# Altium project robot-cortex.PrjPCB (part 1 of 2)
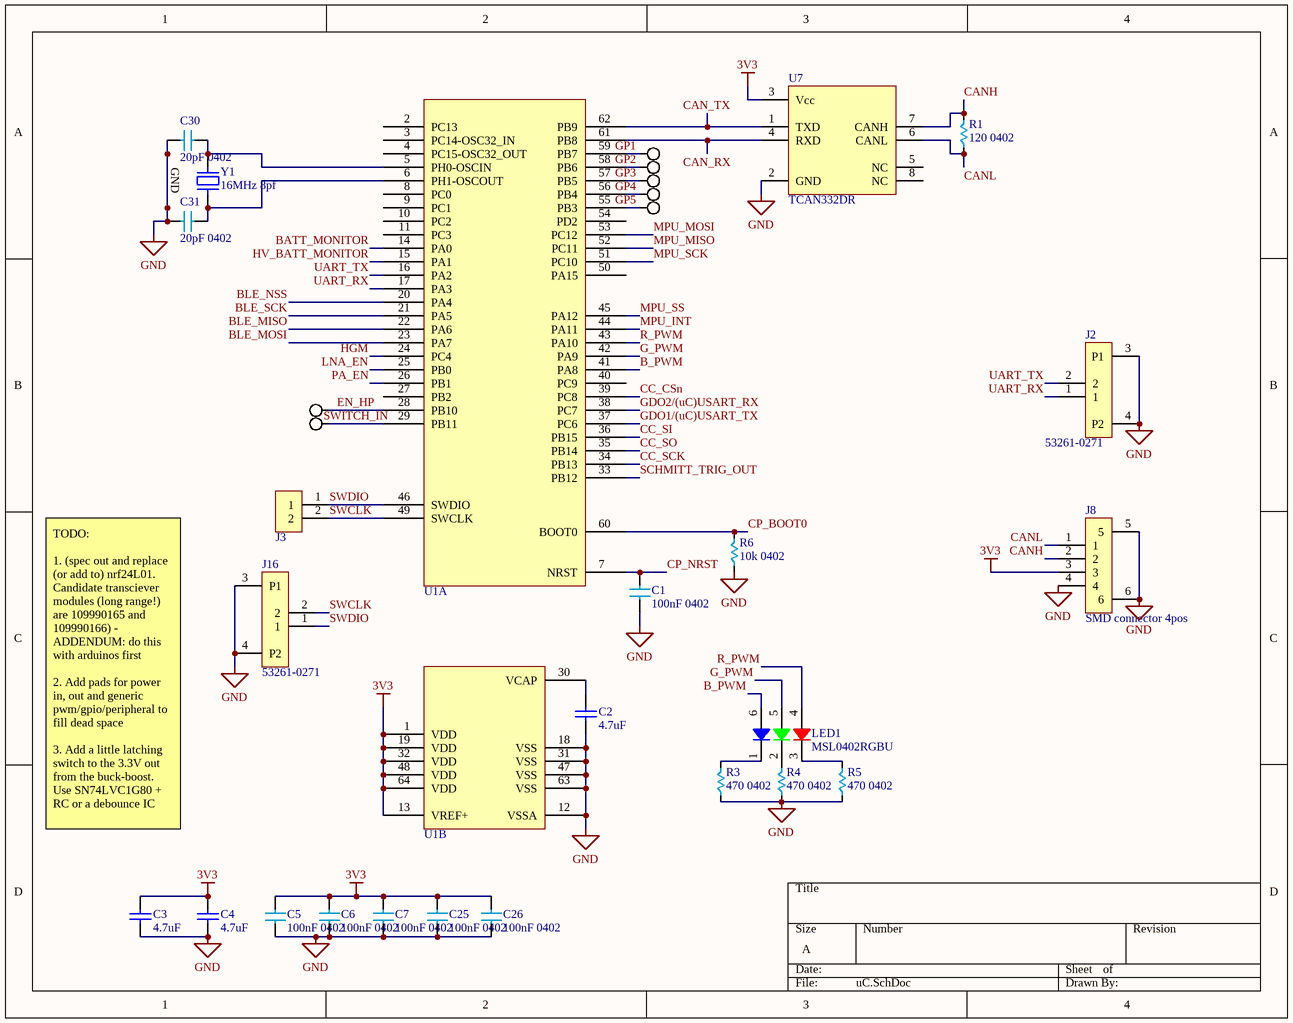
[diagram p0: uC.SchDoc]
6 sheets, 149 parts. Net scope: global (net labels, ports and power ports of the same name join across sheets).
Board file: pcb.PcbDoc
Sheets:
  uC.SchDoc
  power-management.SchDoc
  cp2102.SchDoc
  mpu6500.SchDoc
  CC1101-CC1190.SchDoc
  nrf52-coprocessor.SchDoc

## Sheet uC.SchDoc
size A

### Parts
C1  100nF 0402  [C0402]
C2  value 4.7uF  [C0603]  (hidden comment: 4.7uF 0603)
C3  value 4.7uF  [C0603]  (hidden comment: 4.7uF 0603)
C4  value 4.7uF  [C0603]  (hidden comment: 4.7uF 0603)
C5  100nF 0402  [C0402]
C6  100nF 0402  [C0402]
C7  100nF 0402  [C0402]
C25  100nF 0402  [C0402]
C26  100nF 0402  [C0402]
C30  20pF 0402  [C0402]
C31  20pF 0402  [C0402]
J2  53261-0271  [0532610271]
J3  Header 2  [DUAL_PADS]  (value not drawn)
J5  PAD-SINGLE  [PAD-SINGLE]  (value not drawn)
J6  PAD-SINGLE  [PAD-SINGLE]  (value not drawn)
J8  SMD connector 4pos  [0532610471]
J9  PAD-SINGLE  [PAD-SINGLE]  (value not drawn)
J10  PAD-SINGLE  [PAD-SINGLE]  (value not drawn)
J11  PAD-SINGLE  [PAD-SINGLE]  (value not drawn)
J12  PAD-SINGLE  [PAD-SINGLE]  (value not drawn)
J13  PAD-SINGLE  [PAD-SINGLE]  (value not drawn)
J16  53261-0271  [533980271]
LED1  MSL0402RGBU  [MSL0402RGBU]
R1  120 0402  [R0402]
R3  470 0402  [R0402]
R4  470 0402  [R0402]
R5  470 0402  [R0402]
R6  10k 0402  [R0402]
U1  STM32F730R8T6  [QFP-64]  (value not drawn)  (parts A,B of 2)
U7  TCAN332DR  [SOIC8-D0008A]
Y1  16MHz 8pf  [NDK NX3225GA]

### Nets
3V3: C3.2 C4.2 C5.1 C6.1 C7.1 C25.1 C26.1 J8.3 U1.1(VDD) U1.13(VREF+) U1.19(VDD) U1.32(VDD) U1.48(VDD) U1.64(VDD) U7.3(Vcc)
GND: C1.2 C2.1 C3.1 C4.1 C5.2 C6.2 C7.2 C25.2 C26.2 C30.2 C31.2 J2.3(P1) J2.4(P2) J8.4 J8.5 J8.6 J16.3(P1) J16.4(P2) R3.2 R4.2 R5.2 R6.2 U1.12(VSSA) U1.18(VSS) U1.31(VSS) U1.47(VSS) U1.63(VSS) U7.2(GND) Y1.2(GND) Y1.4(GND)
B_PWM: LED1.6 U1.41(PA8)
BATT_MONITOR: U1.14(PA0)
BLE_MISO: U1.22(PA6)
BLE_MOSI: U1.23(PA7)
BLE_NSS: U1.20(PA4)
BLE_SCK: U1.21(PA5)
CAN_RX: U1.61(PB8) U7.4(RXD)
CAN_TX: U1.62(PB9) U7.1(TXD)
CANH: J8.2 R1.1 U7.7(CANH)
CANL: J8.1 R1.2 U7.6(CANL)
CC_CSn: U1.39(PC8)
CC_SCK: U1.34(PB13)
CC_SI: U1.36(PB15)
CC_SO: U1.35(PB14)
CP_BOOT0: R6.1 U1.60(BOOT0)
CP_NRST: C1.1 U1.7(NRST)
EN_HP: J12.1 U1.28(PB10)
G_PWM: LED1.5 U1.42(PA9)
GDO1/(uC)USART_TX: U1.37(PC6)
GDO2/(uC)USART_RX: U1.38(PC7)
GP1: J5.1 U1.59(PB7)
GP2: J6.1 U1.58(PB6)
GP3: J9.1 U1.57(PB5)
GP4: J10.1 U1.56(PB4)
GP5: J11.1 U1.55(PB3)
HGM: U1.24(PC4)
HV_BATT_MONITOR: U1.15(PA1)
LNA_EN: U1.25(PB0)
MPU_INT: U1.44(PA11)
MPU_MISO: U1.52(PC11)
MPU_MOSI: U1.53(PC12)
MPU_SCK: U1.51(PC10)
MPU_SS: U1.45(PA12)
PA_EN: U1.26(PB1)
R_PWM: LED1.4 U1.43(PA10)
SCHMITT_TRIG_OUT: U1.33(PB12)
SWCLK: J3.2 J16.2 U1.49(SWCLK)
SWDIO: J3.1 J16.1 U1.46(SWDIO)
SWITCH_IN: J13.1 U1.29(PB11)
UART_RX: J2.1 U1.17(PA3)
UART_TX: J2.2 U1.16(PA2)
NetC2_2: C2.2 U1.30(VCAP)
NetC30_1: C30.1 U1.5(PH0-OSCIN) Y1.1
NetC31_1: C31.1 U1.6(PH1-OSCOUT) Y1.3
NetLED1_1: LED1.1 R3.1
NetLED1_2: LED1.2 R4.1
NetLED1_3: LED1.3 R5.1

Not connected (* = marked no-connect by the designer): U1 2(PC13) 3(PC14-OSC32_IN) 4(PC15-OSC32_OUT) 8(PC0) 9(PC1) 10(PC2) 11(PC3) 27(PB2) 40(PC9) 50(PA15) 54(PD2); U7 5(NC) 8(NC)

### Notes on the sheet
- TODO:
  1. (spec out and replace (or add to) nrf24L01. Candidate transciever modules (long range!) are 109990165 and 109990166) - ADDENDUM: do this with arduinos first
  2. Add pads for power in, out and generic pwm/gpio/peripheral to fill dead space
  3. Add a little latching switch to the 3.3V out from the buck-boost. Use SN74LVC1G80 + RC or a debounce IC

### Library data of the parts
C1 C5-C7 C25 C26 = C0402-100nF
C2-C4 = C-4.7uF-0603: Manufacturer: Samsung; Manufacturer Part Number: CL05F104ZO5NNNC; Description 1: Cap Ceramic 0.1uF 16V Y5V -20% to 80% SMD 0402 85C T/R; Material: Ceramic; Tolerance: 80%; Capacitance: 100nF; Dielectric: Y5V; Voltage Rating: 16V; Description 2: Cap Ceramic 4.7uF 6.3V X5R 20% SMD 0603 85C Paper T/R; Voltage Rating (DC): 6.3V; Published: 8-Jun-2000; LatestRevisionDate: 17-Jul-2002; LatestRevisionNote: Re-released for DXP Platform.; PackageReference: RAD-0.3; Publisher: Altium Limited; Supplier 1: Digi-Key; Supplier Part Number 1: 1276-1004-6-ND; Stock: 8058560; Pricing: 1=0.1, 10=0.024, 100=0.0106, 500=0.00756, 1000=0.00595, 2500=0.00541, 5000=0.00497 (USD); Mount: Surface Mount; Case/Package: 0402; Case Code (Metric): 1005; Case Code (Imperial): 0402; Contact Plating: Tin; Min Operating Temperature: -30°C; Max Operating Temperature: 85°C; Packaging: Tape and Reel; Length: 1mm; Height: 0.5mm; Width: 0.02inch; Thickness: 0.022inch; Depth: 0.5mm; Radiation Hardening: No; ComponentLink1URL: http://www1.futureelectronics.com/doc/SAMSUNG/CL05F104ZO5NNNC.pdf; ComponentLink1Description: http://www1.futureelectronics.com/doc/SAMSUNG/CL05F104ZO5NNNC.pdf; ComponentLink2URL: https://www.verical.com/server-webapp/html/getDatasheet?partID=358403; ComponentLink2Description: https://www.verical.com/server-webapp/html/getDatasheet?partID=358403; ComponentLink3URL: https://produktinfo.conrad.com/datenblaetter/450000-474999/458504-da-01-en-VS_KONDENSATOR_0402.pdf; ComponentLink3Description: https://produktinfo.conrad.com/datenblaetter/450000-474999/458504-da-01-en-VS_KONDENSATOR_0402.pdf; Supplier 2: Digi-Key; Supplier Part Number 2: 1276-1907-6-ND; Manufacturer Part Number 2: CL10A475MQ8NNNC; Package Quantity: 4000; Lead Free: Lead Free; ComponentLink4URL: http://www.samsungsem.com/kr/support/product-search/mlcc/CL10A475MQ8NNNC.jsp?src-supplier=Digi-Key; ComponentLink4Description: http://www.samsungsem.com/kr/support/product-search/mlcc/CL10A475MQ8NNNC.jsp?src-supplier=Digi-Key; ComponentLink5URL: https://www.verical.com/server-webapp/html/getDatasheet?partID=358407&src-supplier=Verical; ComponentLink5Description: https://www.verical.com/server-webapp/html/getDatasheet?partID=358407&src-supplier=Verical; ComponentLink6URL: http://www1.futureelectronics.com/doc/SAMSUNG%20PASSIVE/CL05B104KQ5NNNC.pdf?src-supplier=Future+Electronics; ComponentLink6Description: http://www1.futureelectronics.com/doc/SAMSUNG%20PASSIVE/CL05B104KQ5NNNC.pdf?src-supplier=Future+Electronics
C30 C31 = C0402-20pF
J2 J16 = 53261-0271: Headers & Wire Housings 1.25MM HDR 2 CKT Right-Angle; Manufacturer: Molex; Gender: Male; Voltage Rating: 125V; Number of Positions: 2; Current Rating: 1A; Contact Resistance: 20mR; Insulation Resistance: 100MR; Glow Wire Compliant: Non-compliant; Supplier 1: Digi-Key; Supplier Part Number 1: WM7620TR-ND; Manufacturer Part Number 1: 53261-0271; Description 1: Headers & Wire Housings 1.25MM HDR 2 CKT Right-Angle; Stock: 85000; Pricing: 1000=0.4904, 2000=0.45975, 3000=0.44443, 5000=0.4291, 10000=0.40765, 25000=0.39845 (USD); Mount: Surface Mount; Color: Beige; Housing Material: Thermoplastic; Contact Material: Bronze,Tin; Contact Plating: Tin; Min Operating Temperature: -40°C; Max Operating Temperature: 85°C; Packaging: Tape and Reel; Termination: SMD/SMT; Number of Rows: 1; Number of Contacts: 2; Orientation: Right Angle; Package Quantity: 1000; Voltage Rating (AC): 125V; Number of Circuits: 2; Voltage Rating (DC): 125V; Working Voltage: 125V; Pitch: 1.25mm; Lead Pitch: 1.25mm; Radiation Hardening: No; REACH SVHC: Unknown; Lead Free: Lead Free; Flammability Rating: UL94 V-0; ComponentLink1URL: http://uk.rs-online.com/webdocs/13c4/0900766b813c44b8.pdf; ComponentLink1Description: http://uk.rs-online.com/webdocs/13c4/0900766b813c44b8.pdf; ComponentLink2URL: http://www.molex.com/webdocs/datasheets/pdf/en-us/0532610271_PCB_HEADERS.pdf; ComponentLink2Description: http://www.molex.com/webdocs/datasheets/pdf/en-us/0532610271_PCB_HEADERS.pdf; ComponentLink3URL: http://www.alliedelec.com/m/d/74d14d19c60ab078e4881c4c1bd42ef7.pdf; ComponentLink3Description: http://www.alliedelec.com/m/d/74d14d19c60ab078e4881c4c1bd42ef7.pdf; ComponentLink4URL: http://www.farnell.com/datasheets/2697765.pdf; ComponentLink4Description: http://www.farnell.com/datasheets/2697765.pdf; ComponentLink5URL: http://www.farnell.com/datasheets/2144535.pdf; ComponentLink5Description: http://www.farnell.com/datasheets/2144535.pdf; ComponentLink6URL: http://www.farnell.com/datasheets/1626147.pdf; ComponentLink6Description: http://www.farnell.com/datasheets/1626147.pdf; ComponentLink7URL: http://www.mouser.com/ds/2/276/0532610271_PCB_HEADERS-171053.pdf; ComponentLink7Description: http://www.mouser.com/ds/2/276/0532610271_PCB_HEADERS-171053.pdf; ComponentLink8URL: http://www.farnell.com/datasheets/2038817.pdf; ComponentLink8Description: http://www.farnell.com/datasheets/2038817.pdf; ComponentLink9URL: http://www.jameco.com/Jameco/Products/ProdDS/1932547.pdf; ComponentLink9Description: http://www.jameco.com/Jameco/Products/ProdDS/1932547.pdf
J3 = DUAL_PADS
J5 J6 J9-J13 = PAD-SINGLE: Single Thru Hole Pad
J8 = 0532610471: Headers & Wire Housings 1.25MM HDR 4 CKT Right-Angle; Manufacturer: Molex; Manufacturer Part Number 1: 53261-0471; Contact Resistance: 20mR; Number of Positions: 4; Current Rating: 1A; Voltage Rating (AC): 125V; Insulation Resistance: 100MR; Gender: Male; Glow Wire Compliant: Non-compliant; Supplier 1: Digi-Key; Supplier Part Number 1: WM7622DKR-ND; Description 1: Headers & Wire Housings 1.25MM HDR 4 CKT Right-Angle; Stock: 42057; Pricing: 1=1.24, 10=1.089, 100=0.9397, 500=0.76884 (USD); Mount: Surface Mount; Contact Plating: Tin; Contact Material: Bronze,Tin; Color: Beige; Housing Material: Thermoplastic; Min Operating Temperature: -40°C; Max Operating Temperature: 85°C; Orientation: Right Angle; Number of Rows: 1; Packaging: Tape and Reel; Termination: SMD/SMT; Number of Contacts: 4; Voltage Rating: 125V; Package Quantity: 1000; Working Voltage: 125V; Number of Circuits: 4; Voltage Rating (DC): 125V; Pitch: 1.25mm; Lead Pitch: 1.25mm; Radiation Hardening: No; Flammability Rating: UL94 V-0; REACH SVHC: Unknown; Lead Free: Lead Free; ComponentLink1URL: http://www.mouser.com/ds/2/276/0532610471_PCB_HEADERS-170942.pdf; ComponentLink1Description: http://www.mouser.com/ds/2/276/0532610471_PCB_HEADERS-170942.pdf; ComponentLink2URL: http://uk.rs-online.com/webdocs/1380/0900766b8138010d.pdf; ComponentLink2Description: http://uk.rs-online.com/webdocs/1380/0900766b8138010d.pdf; ComponentLink3URL: http://www.farnell.com/datasheets/1867384.pdf; ComponentLink3Description: http://www.farnell.com/datasheets/1867384.pdf; ComponentLink4URL: http://www.molex.com/webdocs/datasheets/pdf/en-us/0532610471_PCB_HEADERS.pdf; ComponentLink4Description: http://www.molex.com/webdocs/datasheets/pdf/en-us/0532610471_PCB_HEADERS.pdf; ComponentLink5URL: https://www.alliedelec.com/m/d/74d14d19c60ab078e4881c4c1bd42ef7.pdf; ComponentLink5Description: https://www.alliedelec.com/m/d/74d14d19c60ab078e4881c4c1bd42ef7.pdf; ComponentLink6URL: http://www.jameco.com/Jameco/Products/ProdDS/1932555.pdf; ComponentLink6Description: http://www.jameco.com/Jameco/Products/ProdDS/1932555.pdf
LED1 = MSL0402RGBU: ROHM         MSL0402RGBU1             LED, Red, Green, Blue, SMD, Rectangular, R 20mA, G 20mA, B 20mA                          New; Color: Blue,Green,Red; Supplier 1: Digi-Key; Supplier Part Number 1: MSL0402RGBU1CT-ND; Manufacturer: Rohm; Manufacturer Part Number: MSL0402RGBU1; Stock 1: 23725; Pricing 1: 1=0.7, 10=0.549, 25=0.4576, 100=0.3942, 250=0.352, 500=0.30272, 1000=0.23373 (USD); Lens Style: Rectangular; Packaging: Cut Tape; REACH SVHC: No SVHC; Lead Free: Lead Free
R1 = R-120-0402: 120 Ohm 0402
R3-R5 = R-470-0402: Manufacturer: Yageo; Manufacturer Part Number: RC0402JR-07470RL; Description 1: RES SMD 470 OHM 5% 1/16W 0402; Tolerance: 5%; Voltage Rating: 50V; Resistance: 470R; Power Rating: 62.5mW; Temperature Coefficient: 100ppm/°C; Max Power Dissipation: 63mW; Supplier 1: Digi-Key; Supplier Part Number 1: 311-470JRDKR-ND; Stock: 2903670; Pricing: 1=0.1, 10=0.013, 100=0.0055, 1000=0.00245, 2500=0.00212, 5000=0.00176 (USD); Case/Package: 0402; Case Code (Metric): 1005; Case Code (Imperial): 0402; Min Operating Temperature: -55°C; Max Operating Temperature: 155°C; Packaging: Tape and Reel; Package Quantity: 1; Termination: SMD/SMT; Composition: Thick Film; Features: Moisture Resistant; Number of Terminations: 2; Military Standard: Not; Working Voltage: 50V; Length: 1mm; Height: 0.016inch; Width: 0.02inch; Depth: 0.5mm; REACH SVHC: Unknown; Lead Free: Lead Free; ComponentLink1URL: http://www.yageo.com/documents/recent/PYu-RC_Group_51_RoHS_L_10.pdf?src-supplier=Digi-Key; ComponentLink1Description: http://www.yageo.com/documents/recent/PYu-RC_Group_51_RoHS_L_10.pdf?src-supplier=Digi-Key; ComponentLink2URL: http://www.farnell.com/datasheets/1018594.pdf?src-supplier=Element14; ComponentLink2Description: http://www.farnell.com/datasheets/1018594.pdf?src-supplier=Element14; ComponentLink3URL: http://www.mouser.com/ds/2/447/PYu-RC0402_51_RoHS_L_6_r-8721.pdf?src-supplier=Mouser; ComponentLink3Description: http://www.mouser.com/ds/2/447/PYu-RC0402_51_RoHS_L_6_r-8721.pdf?src-supplier=Mouser
R6 = R-10k-0402: Value: 10k
U7 = TCAN332: Manufacturer: Texas Instruments; Description 1: TEXAS INSTRUMENTS         TCAN332DR             CAN Bus, 1, 1, 3 V, 3.6 V, SOIC; Receiver Hysteresis: 120mV; Data Rate: 1Mbps; Min Supply Voltage: 3V; Max Supply Voltage: 3.6V; Number of Transmit Buffers: 1; Supplier 1: Digi-Key; Supplier Part Number 1: 296-43711-1-ND; Manufacturer Part Number: TCAN332DR; RoHS: Yes; Category: Interface ICs; Stock: 14429; Pricing: 1=2.01000, 10=1.80200, 25=1.70000, 100=1.36000, 250=1.19000, 500=1.15600, 1000=0.91800 (USD); Mount: Surface Mount; Case/Package: SOIC; Number of Pins: 8; Min Operating Temperature: -40°C; Max Operating Temperature: 125°C; Packaging: Cut Tape; Number of Receive Buffers: 1; Lead Free: Lead Free; REACH SVHC: No SVHC; ComponentLink1URL: http://www.ti.com/lit/ds/symlink/tcan332.pdf?src-supplier=Digi-Key; ComponentLink1Description: http://www.ti.com/lit/ds/symlink/tcan332.pdf?src-supplier=Digi-Key; ComponentLink2URL: http://www.ti.com/lit/gpn/tcan332?src-supplier=Mouser; ComponentLink2Description: http://www.ti.com/lit/gpn/tcan332?src-supplier=Mouser; ComponentLink3URL: http://www.ti.com/general/docs/lit/getliterature.tsp?genericPartNumber=TCAN332&amp;&amp;fileType=pdf&src-supplier=Farnell; ComponentLink3Description: http://www.ti.com/general/docs/lit/getliterature.tsp?genericPartNumber=TCAN332&amp;&amp;fileType=pdf&src-supplier=Farnell; ComponentLink4URL: http://www.ti.com/general/docs/lit/getliterature.tsp?genericPartNumber=TCAN332&&fileType=pdf&src-supplier=Element14; ComponentLink4Description: http://www.ti.com/general/docs/lit/getliterature.tsp?genericPartNumber=TCAN332&&fileType=pdf&src-supplier=Element14
Y1 = NDK Crystal NX3225SA: SMT Crystal; Manufacturer: NDK; Manufacturer Part Number: NX3225SA-16.000000MHZ-T1; Description 2: CRYSTAL 16.0000MHZ 10PF SMD; Frequency Tolerance: 10ppm; Load Capacitance: 10pF; ESR (Equivalent Series Resistance): 80R; Supplier 1: Digi-Key; Supplier Part Number 1: 644-1049-1-ND; Supplier 2: Digi-Key; Supplier Part Number 2: 644-1100-6-ND; Stock: 72540; Pricing: 1=0.92, 10=0.812, 50=0.7592, 100=0.6709, 500=0.63558, 1000=0.52965 (USD); Mount: Surface Mount; Case/Package: SMD/SMT; Min Operating Temperature: -20°C; Max Operating Temperature: 70°C; Frequency: 16MHz; Frequency Stability: 10ppm; Packaging: Tape and Reel; Package Quantity: 3000; Length: 0.126inch; Height: 0.028inch; Width: 0.098inch; Lead Free: Lead Free; ComponentLink1URL: https://media.digikey.com/pdf/Data Sheets/NDK PDFs/NX3225SA-16.000000MHz-T1.pdf?src-supplier=Digi-Key; ComponentLink1Description: https://media.digikey.com/pdf/Data Sheets/NDK PDFs/NX3225SA-16.000000MHz-T1.pdf?src-supplier=Digi-Key

## Sheet power-management.SchDoc
size 304 x 177 mm
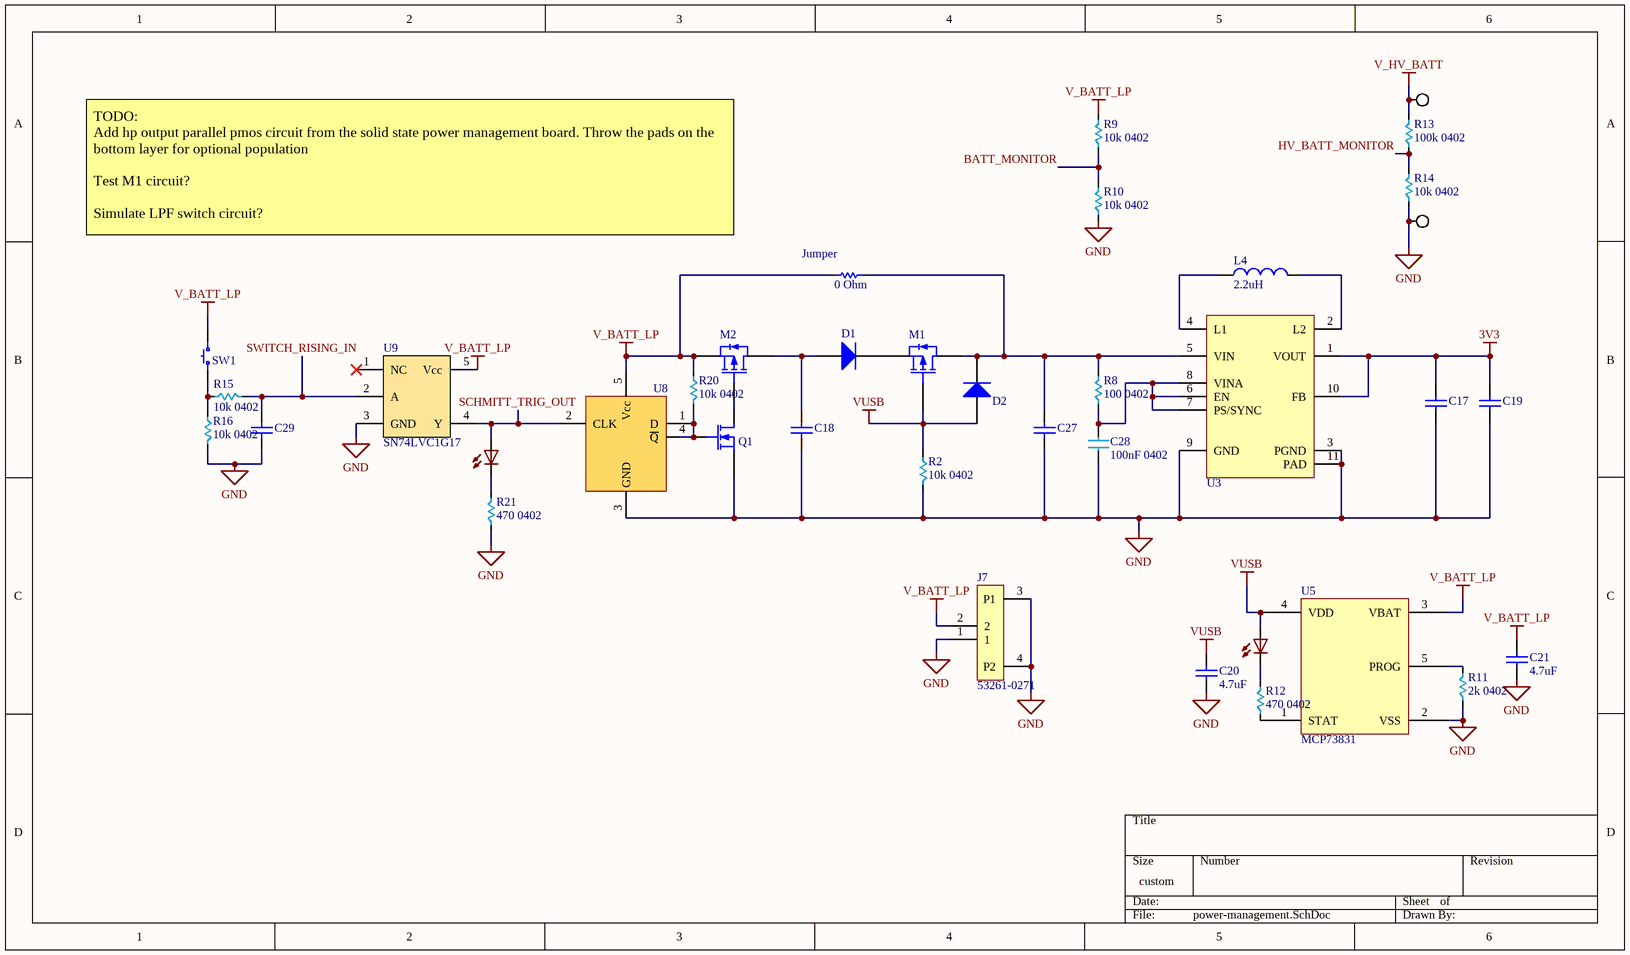
[diagram p1: power-management.SchDoc]

### Parts
0_Ohm  Jumper  [0805-1]
C17  10uF 0603  [C0603]  (value not drawn)
C18  10uF 0603  [C0603]  (value not drawn)
C19  10uF 0603  [C0603]  (value not drawn)
C20  value 4.7uF  [C0603]  (hidden comment: 4.7uF 0603)
C21  value 4.7uF  [C0603]  (hidden comment: 4.7uF 0603)
C27  10uF 0603  [C0603]  (value not drawn)
C28  100nF 0402  [C0402]
C29  10uF 0603  [C0603]  (value not drawn)
D1  NSR0530HT1G  [SOD-323]  (value not drawn)
D2  NSR0530HT1G  [SOD-323]  (value not drawn)
J7  53261-0271  [0532610271]
J18  PAD-SINGLE  [PAD-SINGLE]  (value not drawn)
J19  PAD-SINGLE  [PAD-SINGLE]  (value not drawn)
L4  2.2uH  [L1210]
LED3  LED WHITE 0603  [LED_0603]  (value not drawn)
LED4  LED WHITE 0603  [LED_0603]  (value not drawn)
M1  csd25402q3a  [SON65P330X90-8N]  (value not drawn)
M2  csd25402q3a  [SON65P330X90-8N]  (value not drawn)
Q1  n-mos low power  [SOT-23-3]  (value not drawn)
R2  10k 0402  [R0402]
R8  100 0402  [R0402]
R9  10k 0402  [R0402]
R10  10k 0402  [R0402]
R11  2k 0402  [R0402]
R12  470 0402  [R0402]
R13  100k 0402  [R0402]
R14  10k 0402  [R0402]
R15  10k 0402  [R0402]
R16  10k 0402  [R0402]
R20  10k 0402  [R0402]
R21  470 0402  [R0402]
SW1  EVQ-P7A01P  [EVQ-P7A01P]  (value not drawn)
U3  TPS63001DRCR  [DRC0010J]  (value not drawn)
U5  MCP73831  [SOT-23-5]
U8  SN74LVC1G80DCK  [DCK-SC70-TI]  (value not drawn)
U9  SN74LVC1G17  [DBV-SOT-23]

### Nets
3V3: C17.2 C19.2 U3.1(VOUT) U3.10(FB)
GND: C17.1 C18.1 C19.1 C20.1 C21.1 C27.1 C28.2 C29.2 J7.1 J7.3(P1) J7.4(P2) J19.1 Q1.2(S) R2.1 R10.2 R11.2 R14.2 R16.2 R21.2 U3.3(PGND) U3.9(GND) U3.11(PAD) U5.2(VSS) U8.3(GND) U9.3(GND)
V_BATT_LP: 0_Ohm.1 C21.2 J7.2 M2.3(S) R9.1 R20.2 SW1.2 U5.3(VBAT) U8.5(Vcc) U9.5(Vcc)
V_HV_BATT: J18.1 R13.1
VUSB: C20.2 D2.1(A) LED3.A M1.2(G) R2.2 U5.4(VDD)
BATT_MONITOR: R9.2 R10.1
HV_BATT_MONITOR: R13.2 R14.1
SCHMITT_TRIG_OUT: LED4.A U8.2(CLK) U9.4(Y)
SWITCH_RISING_IN: C29.1 R15.2 U9.2(A)
Net0_Ohm_2: 0_Ohm.2 C27.2 D2.2(K) M1.1(D) R8.1 U3.5(VIN)
NetC18_2: C18.2 D1.1(A) M2.1(D)
NetC28_1: C28.1 R8.2 U3.6(EN) U3.7(PS/SYNC) U3.8(VINA)
NetD1_2: D1.2(K) M1.3(S)
NetL4_1: L4.1 U3.4(L1)
NetL4_2: L4.2 U3.2(L2)
NetLED3_C: LED3.C R12.1
NetLED4_C: LED4.C R21.1
NetM2_2: M2.2(G) Q1.3(D)
NetQ1_1: Q1.1(G) R20.1 U8.1(D) U8.4(~{Q})
NetR11_1: R11.1 U5.5(PROG)
NetR12_2: R12.2 U5.1(STAT)
NetR15_1: R15.1 R16.1 SW1.1

Not connected (* = marked no-connect by the designer): U9 1(NC)*

### Notes on the sheet
- TODO:
  Add hp output parallel pmos circuit from the solid state power management board. Throw the pads on the bottom layer for optional population
  Test M1 circuit?
  Simulate LPF switch circuit?

### Library data of the parts
0_Ohm = R-0-0805: Manufacturer: Panasonic; Manufacturer Part Number: ERJ-6LWJR007V; Value: .007; Description 1: RES 0.007 OHM 5% 1/2W 0805; Resistance: 7mR; Temperature Coefficient: 300ppm/°C; Tolerance: 5%; Max Power Dissipation: 500mW; Footprint: 0805; Supplier 1: Digi-Key; Supplier Part Number 1: P19193DKR-ND; Stock: 3878; Pricing: 1=0.42, 10=0.321, 25=0.2444, 50=0.1816, 100=0.135, 250=0.11404, 500=0.09774, 1000=0.07447 (USD); Case/Package: 0805; Case Code (Metric): 2012; Case Code (Imperial): 0805; Min Operating Temperature: -55°C; Max Operating Temperature: 155°C; Packaging: Tape and Reel; Composition: Thick Film; Number of Terminations: 2; Features: Automotive AEC-Q200; Length: 0.079inch; Height: 0.032inch; Width: 0.049inch
C17-C19 C27 C29 = C-10.0uF-0603
C20 C21 = C-4.7uF-0603: as C2 on sheet uC; Published: 8-Jun-2000; LatestRevisionDate: 17-Jul-2002; LatestRevisionNote: Re-released for DXP Platform.; PackageReference: RAD-0.3; Publisher: Altium Limited; Supplier 1: Digi-Key; Supplier Part Number 1: 1276-1004-6-ND; Stock: 8058560; Pricing: 1=0.1, 10=0.024, 100=0.0106, 500=0.00756, 1000=0.00595, 2500=0.00541, 5000=0.00497 (USD); Mount: Surface Mount; Case/Package: 0402; Case Code (Metric): 1005; Case Code (Imperial): 0402; Contact Plating: Tin; Min Operating Temperature: -30°C; Max Operating Temperature: 85°C; Packaging: Tape and Reel; Length: 1mm; Height: 0.5mm; Width: 0.02inch; Thickness: 0.022inch; Depth: 0.5mm; Radiation Hardening: No; ComponentLink1URL: http://www1.futureelectronics.com/doc/SAMSUNG/CL05F104ZO5NNNC.pdf; ComponentLink1Description: http://www1.futureelectronics.com/doc/SAMSUNG/CL05F104ZO5NNNC.pdf; ComponentLink2URL: https://www.verical.com/server-webapp/html/getDatasheet?partID=358403; ComponentLink2Description: https://www.verical.com/server-webapp/html/getDatasheet?partID=358403; ComponentLink3URL: https://produktinfo.conrad.com/datenblaetter/450000-474999/458504-da-01-en-VS_KONDENSATOR_0402.pdf; ComponentLink3Description: https://produktinfo.conrad.com/datenblaetter/450000-474999/458504-da-01-en-VS_KONDENSATOR_0402.pdf; Supplier 2: Digi-Key; Supplier Part Number 2: 1276-1907-6-ND; Manufacturer Part Number 2: CL10A475MQ8NNNC; Package Quantity: 4000; Lead Free: Lead Free; ComponentLink4URL: http://www.samsungsem.com/kr/support/product-search/mlcc/CL10A475MQ8NNNC.jsp?src-supplier=Digi-Key; ComponentLink4Description: http://www.samsungsem.com/kr/support/product-search/mlcc/CL10A475MQ8NNNC.jsp?src-supplier=Digi-Key; ComponentLink5URL: https://www.verical.com/server-webapp/html/getDatasheet?partID=358407&src-supplier=Verical; ComponentLink5Description: https://www.verical.com/server-webapp/html/getDatasheet?partID=358407&src-supplier=Verical; ComponentLink6URL: http://www1.futureelectronics.com/doc/SAMSUNG%20PASSIVE/CL05B104KQ5NNNC.pdf?src-supplier=Future+Electronics; ComponentLink6Description: http://www1.futureelectronics.com/doc/SAMSUNG%20PASSIVE/CL05B104KQ5NNNC.pdf?src-supplier=Future+Electronics
C28 = C0402-100nF
D1 D2 = NSR0530HT1G: DIODE SCHOTTKY 30V 500MA SOD323; Manufacturer: ON Semiconductor; Forward Voltage: 620mV; Peak Reverse Current: 200uA; Element Configuration: Single; Supplier 1: Digi-Key; Supplier Part Number 1: NSR0530HT1GOSCT-ND; Manufacturer Part Number: NSR0530HT1G; Stock 1: 163499; Pricing 1: 1=0.16, 10=0.149, 100=0.081, 500=0.04986, 1000=0.03399 (USD); Mount: Surface Mount; Case/Package: SOD; Number of Pins: 2; Contact Plating: Tin; Min Operating Temperature: -55°C; Max Operating Temperature: 150°C; Packaging: Cut Tape; Average Rectified Current: 500mA; Max Repetitive Reverse Voltage (Vrrm): 30V; Forward Current: 500mA; Max Reverse Voltage (DC): 30V; REACH SVHC: No SVHC; Lead Free: Lead Free
J7 = 53261-0271: as J2 on sheet uC; Supplier 1: Digi-Key; Supplier Part Number 1: WM7620TR-ND; Manufacturer Part Number 1: 53261-0271; Description 1: Headers & Wire Housings 1.25MM HDR 2 CKT Right-Angle; Stock: 85000; Pricing: 1000=0.4904, 2000=0.45975, 3000=0.44443, 5000=0.4291, 10000=0.40765, 25000=0.39845 (USD); Mount: Surface Mount; Color: Beige; Housing Material: Thermoplastic; Contact Material: Bronze,Tin; Contact Plating: Tin; Min Operating Temperature: -40°C; Max Operating Temperature: 85°C; Packaging: Tape and Reel; Termination: SMD/SMT; Number of Rows: 1; Number of Contacts: 2; Orientation: Right Angle; Package Quantity: 1000; Voltage Rating (AC): 125V; Number of Circuits: 2; Voltage Rating (DC): 125V; Working Voltage: 125V; Pitch: 1.25mm; Lead Pitch: 1.25mm; Radiation Hardening: No; REACH SVHC: Unknown; Lead Free: Lead Free; Flammability Rating: UL94 V-0; ComponentLink1URL: http://uk.rs-online.com/webdocs/13c4/0900766b813c44b8.pdf; ComponentLink1Description: http://uk.rs-online.com/webdocs/13c4/0900766b813c44b8.pdf; ComponentLink2URL: http://www.molex.com/webdocs/datasheets/pdf/en-us/0532610271_PCB_HEADERS.pdf; ComponentLink2Description: http://www.molex.com/webdocs/datasheets/pdf/en-us/0532610271_PCB_HEADERS.pdf; ComponentLink3URL: http://www.alliedelec.com/m/d/74d14d19c60ab078e4881c4c1bd42ef7.pdf; ComponentLink3Description: http://www.alliedelec.com/m/d/74d14d19c60ab078e4881c4c1bd42ef7.pdf; ComponentLink4URL: http://www.farnell.com/datasheets/2697765.pdf; ComponentLink4Description: http://www.farnell.com/datasheets/2697765.pdf; ComponentLink5URL: http://www.farnell.com/datasheets/2144535.pdf; ComponentLink5Description: http://www.farnell.com/datasheets/2144535.pdf; ComponentLink6URL: http://www.farnell.com/datasheets/1626147.pdf; ComponentLink6Description: http://www.farnell.com/datasheets/1626147.pdf; ComponentLink7URL: http://www.mouser.com/ds/2/276/0532610271_PCB_HEADERS-171053.pdf; ComponentLink7Description: http://www.mouser.com/ds/2/276/0532610271_PCB_HEADERS-171053.pdf; ComponentLink8URL: http://www.farnell.com/datasheets/2038817.pdf; ComponentLink8Description: http://www.farnell.com/datasheets/2038817.pdf; ComponentLink9URL: http://www.jameco.com/Jameco/Products/ProdDS/1932547.pdf; ComponentLink9Description: http://www.jameco.com/Jameco/Products/ProdDS/1932547.pdf
J18 J19 = PAD-SINGLE: Single Thru Hole Pad
L4 = DFE322520FD-2R2M=P2: 2.2uH 1210
LED3 LED4 = LED_ESML0603: LED   Source: http://www.osram.convergy.de   Source: www.luxeon.com   Source: www.kingbright.com; Manufacturer: Dialight; Manufacturer Part Number: 5988070107F; Description 1: DIALIGHT - 5988070107F - LED, 0603, GREEN, 20MCD, 566NM; Color: Green; Lens Color: Colorless,Clear; Forward Voltage: 2V; Forward Current: 20mA; Wavelength: 570nm; Luminous Intensity: 20mcd; Viewing Angle: 140°; Lens Style: Flat,Rectangular,Diffused,Colorless,Clear; Dominant Wavelength: 568nm; Number of Elements: 1; Power Dissipation: 60mW; Reverse Voltage: 5V; Lens Transparency: Clear; Lens Size: 0.8mm; SPICEMODEL: NONE; SPICEPREFIX: D; SPICETYPE: diode; Supplier 1: Digi-Key; Supplier Part Number 1: 350-2035-6-ND; Stock: 221494; Pricing: 1=0.48, 10=0.346, 25=0.2652, 100=0.1731, 250=0.12692, 500=0.1077, 1000=0.08846 (USD); Mount: Surface Mount; Case/Package: 0603; Number of Pins: 2; Case Code (Metric): 1608; Case Code (Imperial): 0603; Min Operating Temperature: -30°C; Max Operating Temperature: 100°C; Package Quantity: 4000; Packaging: Tape and Reel; Illumination Color: Green; Test Current: 20mA; Number of LEDs: 1; Length: 1.6mm; Height: 0.7mm; Depth: 0.8mm; Width: 0.8mm; Radiation Hardening: No; Lead Free: Lead Free; REACH SVHC: No SVHC; ComponentLink1URL: http://www.mouser.com/ds/2/109/SMT_selector_guide-267443.pdf?src-supplier=Mouser; ComponentLink1Description: http://www.mouser.com/ds/2/109/SMT_selector_guide-267443.pdf?src-supplier=Mouser; ComponentLink2URL: http://uk.rs-online.com/webdocs/0ae2/0900766b80ae2975.pdf?src-supplier=RSComponents; ComponentLink2Description: http://uk.rs-online.com/webdocs/0ae2/0900766b80ae2975.pdf?src-supplier=RSComponents; ComponentLink3URL: http://www.farnell.com/datasheets/1720200.pdf?src-supplier=Element14; ComponentLink3Description: http://www.farnell.com/datasheets/1720200.pdf?src-supplier=Element14; ComponentLink4URL: https://media.digikey.com/pdf/Data%20Sheets/Dialight%20PDFs/598_Series_0603_Pkg.pdf?src-supplier=Digi-Key; ComponentLink4Description: https://media.digikey.com/pdf/Data%20Sheets/Dialight%20PDFs/598_Series_0603_Pkg.pdf?src-supplier=Digi-Key; ComponentLink5URL: http://www.farnell.com/datasheets/1484480.pdf?src-supplier=Element14; ComponentLink5Description: http://www.farnell.com/datasheets/1484480.pdf?src-supplier=Element14; ComponentLink6URL: https://www.alliedelec.com/m/d/745256ca487aea7b70ea31e2d673d5bb.pdf?src-supplier=Allied+Electronics; ComponentLink6Description: https://www.alliedelec.com/m/d/745256ca487aea7b70ea31e2d673d5bb.pdf?src-supplier=Allied+Electronics; ComponentLink7URL: http://www.onlinecomponents.com/productFiles/mf-DIA/mdei5980603.pdf?src-supplier=Onlinecomponents.com; ComponentLink7Description: http://www.onlinecomponents.com/productFiles/mf-DIA/mdei5980603.pdf?src-supplier=Onlinecomponents.com; ComponentLink8URL: https://www.verical.com/server-webapp/html/getDatasheet?partID=146438&src-supplier=Verical; ComponentLink8Description: https://www.verical.com/server-webapp/html/getDatasheet?partID=146438&src-supplier=Verical; ComponentLink9URL: http://www.dialight.com/Assets/Brochures_And_Catalogs/Indication/SMT_selector_guide.pdf?src-supplier=Future+Electronics; ComponentLink9Description: http://www.dialight.com/Assets/Brochures_And_Catalogs/Indication/SMT_selector_guide.pdf?src-supplier=Future+Electronics
Q1 = NDS351N: Manufacturer: ON Semiconductor / Fairchild; Rds On Max: 160mR; Input Capacitance: 140pF; Drain to Source Voltage (Vdss): 30V; Continuous Drain Current (ID): 1.1A; Max Power Dissipation: 460mW; Gate to Source Voltage (Vgs): 20V; Power Dissipation: 500mW; Element Configuration: Single; Rise Time: 16ns; Turn-Off Delay Time: 26ns; Number of Elements: 1; Turn-On Delay Time: 9ns; Supplier 1: Mouser; Manufacturer Part Number: NDS351N; Stock 1: 2166; Pricing 1: 1=0.46, 10=0.383, 50=0.383, 100=0.234, 1000=0.181, 10000=0.144 (USD); Mount: Surface Mount; Case/Package: TO-236-3; Number of Pins: 3; Weight: 0.03g; Min Operating Temperature: -55°C; Max Operating Temperature: 150°C; Package Quantity: 1; Packaging: Tape and Reel; Drain to Source Breakdown Voltage: 30V; Drain to Source Resistance: 160mR; Fall Time: 16ns; Current Rating: 1.1A; Voltage Rating (DC): 30V; Radiation Hardening: No; Lead Free: Contains Lead; ComponentLink1URL: https://www.verical.com/server-webapp/html/getDatasheet?partID=96049&src-supplier=Verical; ComponentLink1Description: https://www.verical.com/server-webapp/html/getDatasheet?partID=96049&src-supplier=Verical; ComponentLink2URL: https://www.fairchildsemi.com/package-drawings/MA/MA03B.pdf?src-supplier=Digi-Key; ComponentLink2Description: https://www.fairchildsemi.com/package-drawings/MA/MA03B.pdf?src-supplier=Digi-Key; ComponentLink3URL: http://www.fairchildsemi.com/ds/ND/NDS351N.pdf?src-supplier=Avnet+Europe; ComponentLink3Description: http://www.fairchildsemi.com/ds/ND/NDS351N.pdf?src-supplier=Avnet+Europe; ComponentLink4URL: http://www.fairchildsemi.com/ds/ND/NDS351N.pdf?src-supplier=Avnet; ComponentLink4Description: http://www.fairchildsemi.com/ds/ND/NDS351N.pdf?src-supplier=Avnet
R2 R9 R10 R14-R16 R20 = R-10k-0402
R8 = R-100-0402
R11 = R-2k-0402
R12 R21 = R-470-0402: as R3 on sheet uC; Supplier 1: Digi-Key; Supplier Part Number 1: 311-470JRDKR-ND; Stock: 2903670; Pricing: 1=0.1, 10=0.013, 100=0.0055, 1000=0.00245, 2500=0.00212, 5000=0.00176 (USD); Case/Package: 0402; Case Code (Metric): 1005; Case Code (Imperial): 0402; Min Operating Temperature: -55°C; Max Operating Temperature: 155°C; Packaging: Tape and Reel; Package Quantity: 1; Termination: SMD/SMT; Composition: Thick Film; Features: Moisture Resistant; Number of Terminations: 2; Military Standard: Not; Working Voltage: 50V; Length: 1mm; Height: 0.016inch; Width: 0.02inch; Depth: 0.5mm; REACH SVHC: Unknown; Lead Free: Lead Free; ComponentLink1URL: http://www.yageo.com/documents/recent/PYu-RC_Group_51_RoHS_L_10.pdf?src-supplier=Digi-Key; ComponentLink1Description: http://www.yageo.com/documents/recent/PYu-RC_Group_51_RoHS_L_10.pdf?src-supplier=Digi-Key; ComponentLink2URL: http://www.farnell.com/datasheets/1018594.pdf?src-supplier=Element14; ComponentLink2Description: http://www.farnell.com/datasheets/1018594.pdf?src-supplier=Element14; ComponentLink3URL: http://www.mouser.com/ds/2/447/PYu-RC0402_51_RoHS_L_6_r-8721.pdf?src-supplier=Mouser; ComponentLink3Description: http://www.mouser.com/ds/2/447/PYu-RC0402_51_RoHS_L_6_r-8721.pdf?src-supplier=Mouser
R13 = R-100k-0402
SW1 = EVQ-P7A01P: SWITCH TACTILE SPST-NO 50MA 32V; Manufacturer: ITT C&K; Manufacturer Part Number: KMR742NGLFS; Mechanical Life: 200000Cycles; Illumination Type: Non-Illuminated; Operating Force: 400gf; Throw Configuration: SPST; Switch Function: Off-Mom; Actuator Type: Standard; Ratings: IP67,Waterproof,Dust Tight; Supplier 1: Digi-Key; Supplier Part Number 1: CKN10689CT-ND; Stock 1: 44684; Pricing 1: 1=0.35, 10=0.343, 25=0.3304, 50=0.3182, 100=0.306, 250=0.28152, 500=0.24482, 1000=0.20809 (USD); Mount: Surface Mount; Min Operating Temperature: -40°C; Max Operating Temperature: 85°C; Packaging: Tape and Reel; Termination: Gull Wing
U8 = SN74LVC1G80DCK: Flip Flop Inverted Output
U9 = SN74LVC1G17: TEXAS INSTRUMENTS - SN74LVC1G17DBVR - Buffer, 74LVC1G17, 1.65 V to 5.5 V, SOT-23-5; Logic Function: Schmitt Trigger,Buffer; Max Supply Voltage: 5.5V; Min Supply Voltage: 1.65V; Number of Elements: 1; Low Level Output Current: 32mA; Polarity: Non-Inverting; Propagation Delay: 5ns; High Level Output Current: -32mA; Turn-On Delay Time: 11ns; Quiescent Current: 1.5uA; Schmitt Trigger Input: Yes; Supplier 1: Digi-Key; Manufacturer: Texas Instruments; RoHS: Yes; Category: Buffers, Drivers and Transceivers; Stock 1: 149811; Pricing 1: 1=0.32000, 10=0.26200, 25=0.21960, 100=0.13900, 250=0.10728, 500=0.09142, 1000=0.06217 (USD); Mount: Surface Mount; Case/Package: SOT-23; Number of Pins: 5; Contact Plating: Tin,Matte; Min Operating Temperature: -40°C; Max Operating Temperature: 125°C; Packaging: Tape and Reel; Package Quantity: 3000; Number of Bits per Element: 1; Number of Bits: 1; Number of Input Lines: 1; Number of Output Lines: 1; Number of Outputs: 1; Number of Channels: 1; Number of Inputs: 1; Number of Gates: 1; Termination: SMD/SMT; Length: 2.9mm; Width: 1.6mm; Height: 1.15mm; Radiation Hardening: No; Lead Free: Lead Free; RoHS Compliant: Yes; REACH SVHC: No SVHC; ComponentLink1URL: https://datasheet.ciiva.com/34301/756684-34301476.pdf?src-supplier=Jameco; ComponentLink1Description: https://datasheet.ciiva.com/34301/756684-34301476.pdf?src-supplier=Jameco; ComponentLink2URL: https://datasheet.ciiva.com/15094/getdatasheetpartid-189714-15094971.pdf?src-supplier=Verical; ComponentLink2Description: https://datasheet.ciiva.com/15094/getdatasheetpartid-189714-15094971.pdf?src-supplier=Verical; ComponentLink3URL: https://datasheet.ciiva.com/1833/sn74lvc1g17-1833621.pdf?src-supplier=Digi-Key; ComponentLink3Description: https://datasheet.ciiva.com/1833/sn74lvc1g17-1833621.pdf?src-supplier=Digi-Key; ComponentLink4URL: https://datasheet.ciiva.com/1833/sn74lvc1g17-1833622.pdf?src-supplier=Digi-Key; ComponentLink4Description: https://datasheet.ciiva.com/1833/sn74lvc1g17-1833622.pdf?src-supplier=Digi-Key; ComponentLink5URL: https://datasheet.ciiva.com/1833/sn74lvc1g17-1833623.pdf?src-supplier=Digi-Key; ComponentLink5Description: https://datasheet.ciiva.com/1833/sn74lvc1g17-1833623.pdf?src-supplier=Digi-Key; ComponentLink6URL: https://datasheet.ciiva.com/28594/1772570-28594805.pdf?src-supplier=Element14; ComponentLink6Description: https://datasheet.ciiva.com/28594/1772570-28594805.pdf?src-supplier=Element14; ComponentLink7URL: https://datasheet.ciiva.com/7744/1811088-7744197.pdf?src-supplier=Element14; ComponentLink7Description: https://datasheet.ciiva.com/7744/1811088-7744197.pdf?src-supplier=Element14; ComponentLink8URL: https://datasheet.ciiva.com/48702/001073974-da-01-en-ic-buffer-s-sn74lvc1g17dbvr-sot-23-5-tid-48702678.pdf?src-supplier=Conrad; ComponentLink8Description: https://datasheet.ciiva.com/48702/001073974-da-01-en-ic-buffer-s-sn74lvc1g17dbvr-sot-23-5-tid-48702678.pdf?src-supplier=Conrad; Supplier Part Number 1: 296-11933-1-ND; Manufacturer Part Number: SN74LVC1G17DBVR

## Sheet cp2102.SchDoc
size A
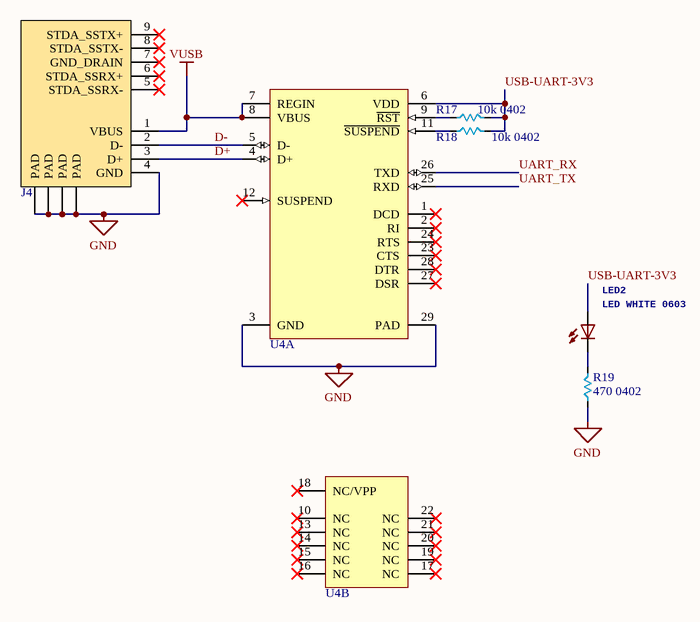
[diagram p2: cp2102.SchDoc]

### Parts
J4  0483930003  [0483930003]  (value not drawn)
LED2  LED WHITE 0603  [LED_0603]
R17  10k 0402  [R0402]
R18  10k 0402  [R0402]
R19  470 0402  [R0402]
U4  CP2102-GM  [QFN28]  (value not drawn)  (parts A,B of 2)

### Nets
GND: J4.4(GND) J4.10(PAD) J4.11(PAD) J4.12(PAD) J4.13(PAD) R19.2 U4.3(GND) U4.29(PAD)
VUSB: J4.1(VBUS) U4.7(REGIN) U4.8(VBUS)
D+: J4.3(D+) U4.4(D+)
D-: J4.2(D-) U4.5(D-)
UART_RX: U4.26(TXD)
UART_TX: U4.25(RXD)
USB-UART-3V3: LED2.A R17.1 R18.1 U4.6(VDD)
NetLED2_C: LED2.C R19.1
NetR17_2: R17.2 U4.9(~{RST})
NetR18_2: R18.2 U4.11(~{SUSPEND})

Not connected (* = marked no-connect by the designer): J4 5(STDA_SSRX-)* 6(STDA_SSRX+)* 7(GND_DRAIN)* 8(STDA_SSTX-)* 9(STDA_SSTX+)*; U4 1(DCD)* 2(RI)* 10(NC)* 12(SUSPEND)* 13(NC)* 14(NC)* 15(NC)* 16(NC)* 17(NC)* 18(NC/VPP)* 19(NC)* 20(NC)* 21(NC)* 22(NC)* 23(CTS)* 24(RTS)* 27(DSR)* 28(DTR)*

### Library data of the parts
J4 = 0483930003: Conn USB Type A F 9 POS 2mm/2.5mm Solder RA Thru-Hole 9 Terminal 1 Port Embossed T/R; Manufacturer: Molex; Number of Contacts: 9; Gender: Receptacle; Supplier 1: Digi-Key; Manufacturer Part Number: 0483930003; RoHS: Yes; Category: Connectors; Stock 1: 7788; Pricing 1: 1=1.74000, 10=1.57900, 25=1.48240, 50=1.41780, 100=1.35340 (USD); Mount: Through Hole,Horizontal; Packaging: Tape and Reel; Termination: Solder; Orientation: Right Angle; Connector Type: USB; Package Quantity: 300; Radiation Hardening: No; ComponentLink1URL: https://datasheet.ciiva.com/29660/987651-0181-29660134.pdf?src-supplier=Digi-Key; ComponentLink1Description: https://datasheet.ciiva.com/29660/987651-0181-29660134.pdf?src-supplier=Digi-Key; ComponentLink2URL: https://datasheet.ciiva.com/29660/987651-0181-29660135.pdf?src-supplier=Digi-Key; ComponentLink2Description: https://datasheet.ciiva.com/29660/987651-0181-29660135.pdf?src-supplier=Digi-Key; Supplier Part Number 1: WM10413CT-ND
LED2 = LED_ESML0603: as LED3 on sheet power-management; SPICEMODEL: NONE; SPICEPREFIX: D; SPICETYPE: diode; Supplier 1: Digi-Key; Supplier Part Number 1: 350-2035-6-ND; Stock: 221494; Pricing: 1=0.48, 10=0.346, 25=0.2652, 100=0.1731, 250=0.12692, 500=0.1077, 1000=0.08846 (USD); Mount: Surface Mount; Case/Package: 0603; Number of Pins: 2; Case Code (Metric): 1608; Case Code (Imperial): 0603; Min Operating Temperature: -30°C; Max Operating Temperature: 100°C; Package Quantity: 4000; Packaging: Tape and Reel; Illumination Color: Green; Test Current: 20mA; Number of LEDs: 1; Length: 1.6mm; Height: 0.7mm; Depth: 0.8mm; Width: 0.8mm; Radiation Hardening: No; Lead Free: Lead Free; REACH SVHC: No SVHC; ComponentLink1URL: http://www.mouser.com/ds/2/109/SMT_selector_guide-267443.pdf?src-supplier=Mouser; ComponentLink1Description: http://www.mouser.com/ds/2/109/SMT_selector_guide-267443.pdf?src-supplier=Mouser; ComponentLink2URL: http://uk.rs-online.com/webdocs/0ae2/0900766b80ae2975.pdf?src-supplier=RSComponents; ComponentLink2Description: http://uk.rs-online.com/webdocs/0ae2/0900766b80ae2975.pdf?src-supplier=RSComponents; ComponentLink3URL: http://www.farnell.com/datasheets/1720200.pdf?src-supplier=Element14; ComponentLink3Description: http://www.farnell.com/datasheets/1720200.pdf?src-supplier=Element14; ComponentLink4URL: https://media.digikey.com/pdf/Data%20Sheets/Dialight%20PDFs/598_Series_0603_Pkg.pdf?src-supplier=Digi-Key; ComponentLink4Description: https://media.digikey.com/pdf/Data%20Sheets/Dialight%20PDFs/598_Series_0603_Pkg.pdf?src-supplier=Digi-Key; ComponentLink5URL: http://www.farnell.com/datasheets/1484480.pdf?src-supplier=Element14; ComponentLink5Description: http://www.farnell.com/datasheets/1484480.pdf?src-supplier=Element14; ComponentLink6URL: https://www.alliedelec.com/m/d/745256ca487aea7b70ea31e2d673d5bb.pdf?src-supplier=Allied+Electronics; ComponentLink6Description: https://www.alliedelec.com/m/d/745256ca487aea7b70ea31e2d673d5bb.pdf?src-supplier=Allied+Electronics; ComponentLink7URL: http://www.onlinecomponents.com/productFiles/mf-DIA/mdei5980603.pdf?src-supplier=Onlinecomponents.com; ComponentLink7Description: http://www.onlinecomponents.com/productFiles/mf-DIA/mdei5980603.pdf?src-supplier=Onlinecomponents.com; ComponentLink8URL: https://www.verical.com/server-webapp/html/getDatasheet?partID=146438&src-supplier=Verical; ComponentLink8Description: https://www.verical.com/server-webapp/html/getDatasheet?partID=146438&src-supplier=Verical; ComponentLink9URL: http://www.dialight.com/Assets/Brochures_And_Catalogs/Indication/SMT_selector_guide.pdf?src-supplier=Future+Electronics; ComponentLink9Description: http://www.dialight.com/Assets/Brochures_And_Catalogs/Indication/SMT_selector_guide.pdf?src-supplier=Future+Electronics
R17 R18 = R-10k-0402
R19 = R-470-0402: as R3 on sheet uC; Supplier 1: Digi-Key; Supplier Part Number 1: 311-470JRDKR-ND; Stock: 2903670; Pricing: 1=0.1, 10=0.013, 100=0.0055, 1000=0.00245, 2500=0.00212, 5000=0.00176 (USD); Case/Package: 0402; Case Code (Metric): 1005; Case Code (Imperial): 0402; Min Operating Temperature: -55°C; Max Operating Temperature: 155°C; Packaging: Tape and Reel; Package Quantity: 1; Termination: SMD/SMT; Composition: Thick Film; Features: Moisture Resistant; Number of Terminations: 2; Military Standard: Not; Working Voltage: 50V; Length: 1mm; Height: 0.016inch; Width: 0.02inch; Depth: 0.5mm; REACH SVHC: Unknown; Lead Free: Lead Free; ComponentLink1URL: http://www.yageo.com/documents/recent/PYu-RC_Group_51_RoHS_L_10.pdf?src-supplier=Digi-Key; ComponentLink1Description: http://www.yageo.com/documents/recent/PYu-RC_Group_51_RoHS_L_10.pdf?src-supplier=Digi-Key; ComponentLink2URL: http://www.farnell.com/datasheets/1018594.pdf?src-supplier=Element14; ComponentLink2Description: http://www.farnell.com/datasheets/1018594.pdf?src-supplier=Element14; ComponentLink3URL: http://www.mouser.com/ds/2/447/PYu-RC0402_51_RoHS_L_6_r-8721.pdf?src-supplier=Mouser; ComponentLink3Description: http://www.mouser.com/ds/2/447/PYu-RC0402_51_RoHS_L_6_r-8721.pdf?src-supplier=Mouser
U4 = CP2102-GM: USB-UART Bridge

## Sheet mpu6500.SchDoc
size A
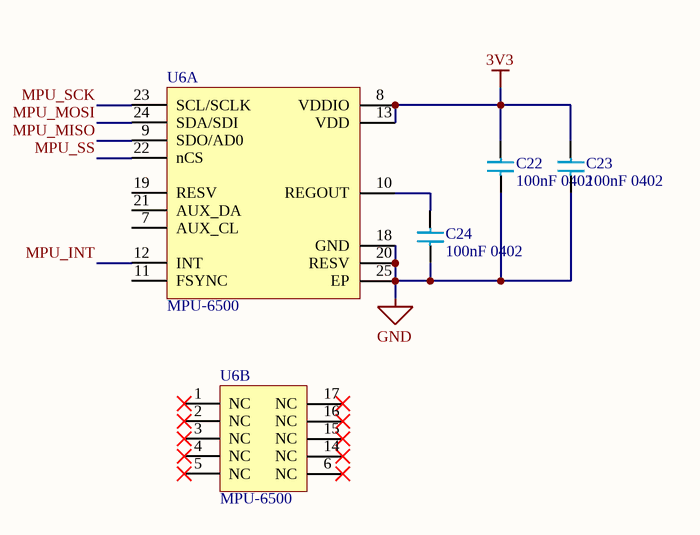
[diagram p3: mpu6500.SchDoc]

### Parts
C22  100nF 0402  [C0402]
C23  100nF 0402  [C0402]
C24  100nF 0402  [C0402]
U6  MPU-6500  [QFN24]  (parts A,B of 2)

### Nets
3V3: C22.1 C23.1 U6.8(VDDIO) U6.13(VDD)
GND: C22.2 C23.2 C24.2 U6.18(GND) U6.20(RESV) U6.25(EP)
MPU_INT: U6.12(INT)
MPU_MISO: U6.9(SDO/AD0)
MPU_MOSI: U6.24(SDA/SDI)
MPU_SCK: U6.23(SCL/SCLK)
MPU_SS: U6.22(nCS)
NetC24_1: C24.1 U6.10(REGOUT)

Not connected (* = marked no-connect by the designer): U6 1(NC)* 2(NC)* 3(NC)* 4(NC)* 5(NC)* 6(NC)* 7(AUX_CL) 11(FSYNC) 14(NC)* 15(NC)* 16(NC)* 17(NC)* 19(RESV) 21(AUX_DA)

### Library data of the parts
C22-C24 = C0402-100nF
U6 = MPU-6500: GYRO/ACCELEROMETER 6AXIS 24QFN; Manufacturer: TDK InvenSense; Sensor Type: Accelerometer,Gyroscope; Output Type: Digital; Operating Supply Voltage: 3.45V; Supplier 1: Digi-Key; Supplier Part Number 1: 1428-1011-1-ND; Manufacturer Part Number: MPU-6500; Stock 1: 29119; Pricing 1: 1=8.31, 5=7.288, 10=6.559, 25=5.83, 50=5.3928, 100=4.664, 500=4.3725, 1000=4.081 (USD); Mount: Surface Mount; Case/Package: QFN; Number of Pins: 24; Min Operating Temperature: -40°C; Max Operating Temperature: 85°C; Package Quantity: 5000; ComponentLink1URL: http://store.invensense.com/Datasheets/invensense/RM-MPU-6500A-00.pdf; ComponentLink1Description: http://store.invensense.com/Datasheets/invensense/RM-MPU-6500A-00.pdf

## Sheet CC1101-CC1190.SchDoc
size 508 x 254 mm; Organization: Altium Limited; Address1: L3, 12a Rodborough Rd; Address2: Frenchs Forest; Address3: NSW; Address4: Australia 2086
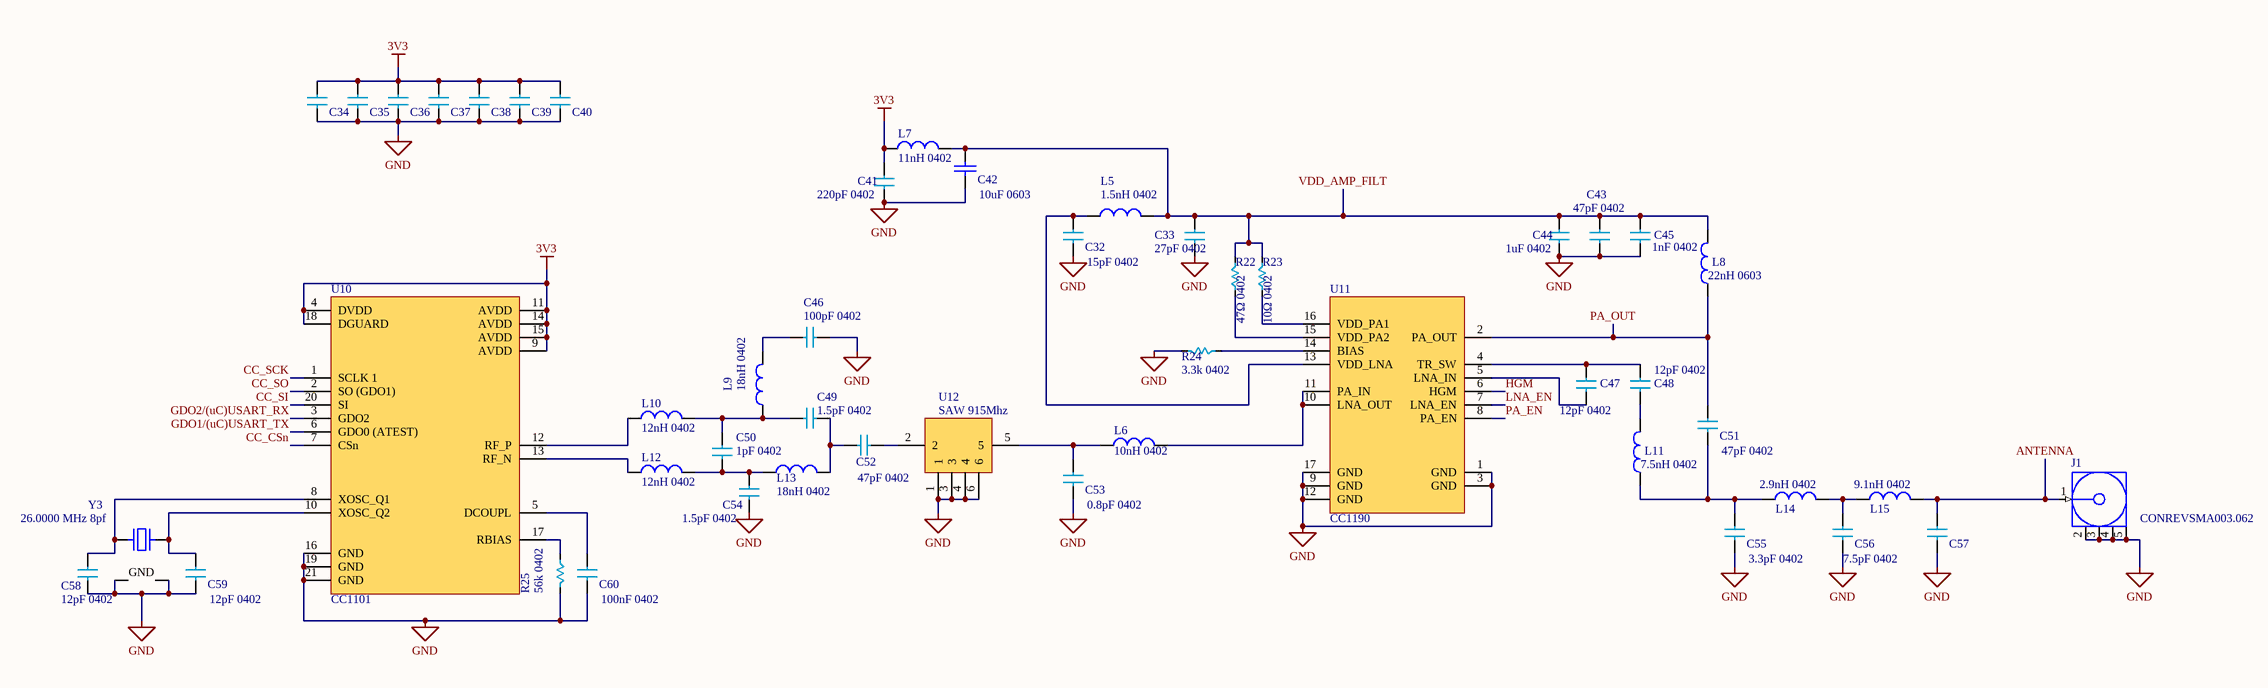
[diagram p4: CC1101-CC1190.SchDoc]

### Parts
C32  15pF 0402  [C0402]
C33  27pF 0402  [C0402]
C34  100nF 0402  [C0402]  (value not drawn)
C35  100nF 0402  [C0402]  (value not drawn)
C36  100nF 0402  [C0402]  (value not drawn)
C37  100nF 0402  [C0402]  (value not drawn)
C38  100nF 0402  [C0402]  (value not drawn)
C39  100nF 0402  [C0402]  (value not drawn)
C40  100nF 0402  [C0402]  (value not drawn)
C41  220pF 0402  [C0402]
C42  10uF 0603  [C0603]
C43  47pF 0402  [C0402]
C44  1uF 0402  [C0402]
C45  1nF 0402  [C0402]
C46  100pF 0402  [C0402]
C47  12pF 0402  [C0402]
C48  12pF 0402  [C0402]
C49  1.5pF 0402  [C0402]
C50  1pF 0402  [C0402]
C51  47pF 0402  [C0402]
C52  47pF 0402  [C0402]
C53  0.8pF 0402  [C0402]
C54  1.5pF 0402  [C0402]
C55  3.3pF 0402  [C0402]
C56  7.5pF 0402  [C0402]
C57  Placeholder  [C0402]  (value not drawn)
C58  12pF 0402  [C0402]
C59  12pF 0402  [C0402]
C60  100nF 0402  [C0402]
J1  CONREVSMA003.062  [CON-SMA-EDGE062]
L5  1.5nH 0402  [L0402]
L6  10nH 0402  [L0402]
L7  11nH 0402  [L0402]
L8  22nH 0603  [L0603]
L9  18nH 0402  [L0402]
L10  12nH 0402  [L0402]
L11  7.5nH 0402  [L0402]
L12  12nH 0402  [L0402]
L13  18nH 0402  [L0402]
L14  2.9nH 0402  [L0402]
L15  9.1nH 0402  [L0402]
R22  47Ω 0402  [R0402]
R23  10Ω 0402  [R0402]
R24  3.3k 0402  [R0402]
R25  56k 0402  [R0402]
U10  CC1101  [QFN20-TI]
U11  CC1190  [QFN16-TI]
U12  SAW 915Mhz  [DCC6C]
Y3  26.0000 MHz 8pf  [NDK NX3225GA]

### Nets
3V3: C34.2 C35.2 C36.2 C37.2 C38.2 C39.2 C40.2 C41.1 L7.1 U10.4(DVDD) U10.9(AVDD) U10.11(AVDD) U10.14(AVDD) U10.15(AVDD) U10.18(DGUARD)
GND: C32.2 C33.2 C34.1 C35.1 C36.1 C37.1 C38.1 C39.1 C40.1 C41.2 C42.1 C43.2 C44.2 C45.2 C46.1 C53.2 C54.1 C55.2 C56.2 C57.2 C58.1 C59.1 C60.1 J1.2(GND) J1.3(GND) J1.4(GND) J1.5(GND) R24.1 R25.1 U10.16(GND) U10.19(GND) U10.21(GND) U11.1(GND) U11.3(GND) U11.9(GND) U11.12(GND) U11.17(GND) U12.1 U12.3 U12.4 U12.6 Y3.2(GND) Y3.4(GND)
ANTENNA: C57.1 J1.1(Signal) L15.2
CC_CSn: U10.7(CSn)
CC_SCK: U10.1(SCLK_1)
CC_SI: U10.20(SI)
CC_SO: U10.2(SO_(GDO1))
GDO1/(uC)USART_TX: U10.6(GDO0_(ATEST))
GDO2/(uC)USART_RX: U10.3(GDO2)
HGM: U11.6(HGM)
LNA_EN: U11.7(LNA_EN)
PA_EN: U11.8(PA_EN)
PA_OUT: C51.1 L8.1 U11.2(PA_OUT)
VDD_AMP_FILT: C33.1 C42.2 C43.1 C44.1 C45.1 L5.2 L7.2 L8.2 R22.1 R23.1
NetC32_1: C32.1 L5.1 U11.13(VDD_LNA)
NetC46_2: C46.2 L9.2
NetC47_1: C47.1 C48.1 U11.4(TR_SW)
NetC47_2: C47.2 U11.5(LNA_IN)
NetC48_2: C48.2 L11.2
NetC49_1: C49.1 C50.2 L9.1 L10.2
NetC49_2: C49.2 C52.1 L13.2
NetC50_1: C50.1 C54.2 L12.2 L13.1
NetC51_2: C51.2 C55.1 L11.1 L14.1
NetC52_2: C52.2 U12.2
NetC53_1: C53.1 L6.1 U12.5
NetC56_1: C56.1 L14.2 L15.1
NetC58_2: C58.2 U10.8(XOSC_Q1) Y3.1
NetC59_2: C59.2 U10.10(XOSC_Q2) Y3.3
NetC60_2: C60.2 U10.5(DCOUPL)
NetL6_2: L6.2 U11.10(LNA_OUT) U11.11(PA_IN)
NetL10_1: L10.1 U10.12(RF_P)
NetL12_1: L12.1 U10.13(RF_N)
NetR22_2: R22.2 U11.15(VDD_PA2)
NetR23_2: R23.2 U11.16(VDD_PA1)
NetR24_2: R24.2 U11.14(BIAS)
NetR25_2: R25.2 U10.17(RBIAS)

### Notes on the sheet
- Title
- Size:
- Date:
- A4
- Number:
- Time:
- Revision:
- Sheet
- of
- File:

### Library data of the parts
C32 = C0402-15pF
C33 = C0402-27pF
C34-C40 C60 = C0402-100nF
C41 = C0402-220pF
C42 = C-10.0uF-0603
C43 C51 C52 = C0402-47pF
C44 = C0402-1uF
C45 = C0402-1nF
C46 = C0402-100pF
C47 C48 C58 C59 = C0402-12pF
C49 C54 = C0402-1.5pF
C50 = C0402-1pF
C53 = C0402-0.8pF
C55 = C0402-3.3pF
C56 = C0402-7.5pF
C57 = C0402-?: Placeholder Cap
J1 = CONREVSMA003.062: RP-SMA Female Edge Mount Connector for 0.062" Thick Board; PCB_Layout: Pads complies with manufacturer's recommendation.; PackageVersion: rev1.0, Jun-2006; DatasheetVersion: rev1.0, Jun-2006; PackageDescription: SMA Female Edge Mount for Connector 0.062" Thick Board, Reverse-polarity, 7.9 mm Body Dia.; PackageReference: CON-SMA-EDGE062; PartNumber: CONREVSMA003.062
L5 = L0402-1.5nH
L6 = L0402-10nH
L7 = L0402-11nH
L8 = L0603-22nH
L9 L13 = L0402-18nH
L10 L12 = L0402-12nH
L11 = L0402-7.5nH
L14 = L0402-2.9
L15 = L0402-9.1nH
R22 = R-47-0402
R23 = R-10-0402
R24 = R-3.3k-0402
R25 = R-56k-0402
U10 = CC1101: RF Transceiver IC
U11 = CC1190: RF frontend
U12 = B39921B3726U410: FILTER SAW 915MHZ REMOTE SMD; Manufacturer: TDK EPCOS; Load Impedance: 50R; Bandwidth: 10MHz; Insertion Loss: 2.6dB; Supplier 1: Newark; RoHS: Yes; Category: EMI / RFI Components; Mount: Surface Mount; Case/Package: SMD/SMT; Number of Pins: 6; Min Operating Temperature: -45°C; Max Operating Temperature: 125°C; Package Quantity: 9000; Frequency: 915MHz; Impedance: 50R; Packaging: Tape and Reel; Termination: SMD/SMT; Series: *; Length: 3mm; Width: 0.118inch; Height: 1.1mm; Ratings: AEC-Q200; Radiation Hardening: No; Lead Free: Lead Free; ComponentLink1URL: https://datasheet.ciiva.com/3073/b3726-3073185.pdf?src-supplier=Avnet; ComponentLink1Description: https://datasheet.ciiva.com/3073/b3726-3073185.pdf?src-supplier=Avnet; ComponentLink2URL: https://datasheet.ciiva.com/4548/b3726-58910-4548209.pdf?src-supplier=Mouser; ComponentLink2Description: https://datasheet.ciiva.com/4548/b3726-58910-4548209.pdf?src-supplier=Mouser; ComponentLink3URL: https://datasheet.ciiva.com/15161/getdatasheetpartid-330732-15161563.pdf?src-supplier=Verical; ComponentLink3Description: https://datasheet.ciiva.com/15161/getdatasheetpartid-330732-15161563.pdf?src-supplier=Verical; ComponentLink4URL: https://datasheet.ciiva.com/16628/b3726-16628731.pdf?src-supplier=Avnet+Europe; ComponentLink4Description: https://datasheet.ciiva.com/16628/b3726-16628731.pdf?src-supplier=Avnet+Europe; ComponentLink5URL: https://datasheet.ciiva.com/6203/b3726-6203485.pdf?src-supplier=Digi-Key; ComponentLink5Description: https://datasheet.ciiva.com/6203/b3726-6203485.pdf?src-supplier=Digi-Key; Supplier Part Number 1: 50R8492; Manufacturer Part Number: B39921B3726U410
Y3 = NX3225SA-26.000M-STD-CSR-3: Crystal 26MHz 8pF 4-Pin SMD; Manufacturer: NDK; ESR (Equivalent Series Resistance): 50R; Frequency Stability: 15ppm; Supplier 1: Digi-Key; RoHS: Yes; Category: Crystals; Stock 1: 11873; Pricing 1: 1=0.99000, 10=0.87400, 50=0.81700, 100=0.72200, 500=0.68400, 1000=0.57000 (USD); Mount: Surface Mount; Case/Package: SMD/SMT; Number of Pins: 4; Min Operating Temperature: -10°C; Max Operating Temperature: 75°C; Frequency: 26MHz; Packaging: Tape and Reel; Load Capacitance: 8pF; Frequency Tolerance: 15ppm; Length: 0.126inch; Width: 0.098inch; Height: 0.024inch; Lead Free: Lead Free; ComponentLink1URL: https://datasheet.ciiva.com/18026/getdatasheetpartid-683563-18026983.pdf?src-supplier=Verical; ComponentLink1Description: https://datasheet.ciiva.com/18026/getdatasheetpartid-683563-18026983.pdf?src-supplier=Verical; Supplier Part Number 1: 644-1270-1-ND; Manufacturer Part Number: NX3225SA-26.000M-STD-CSR-3